# Altium schematic sheet nfc-epd-top.SchDoc
size Letter
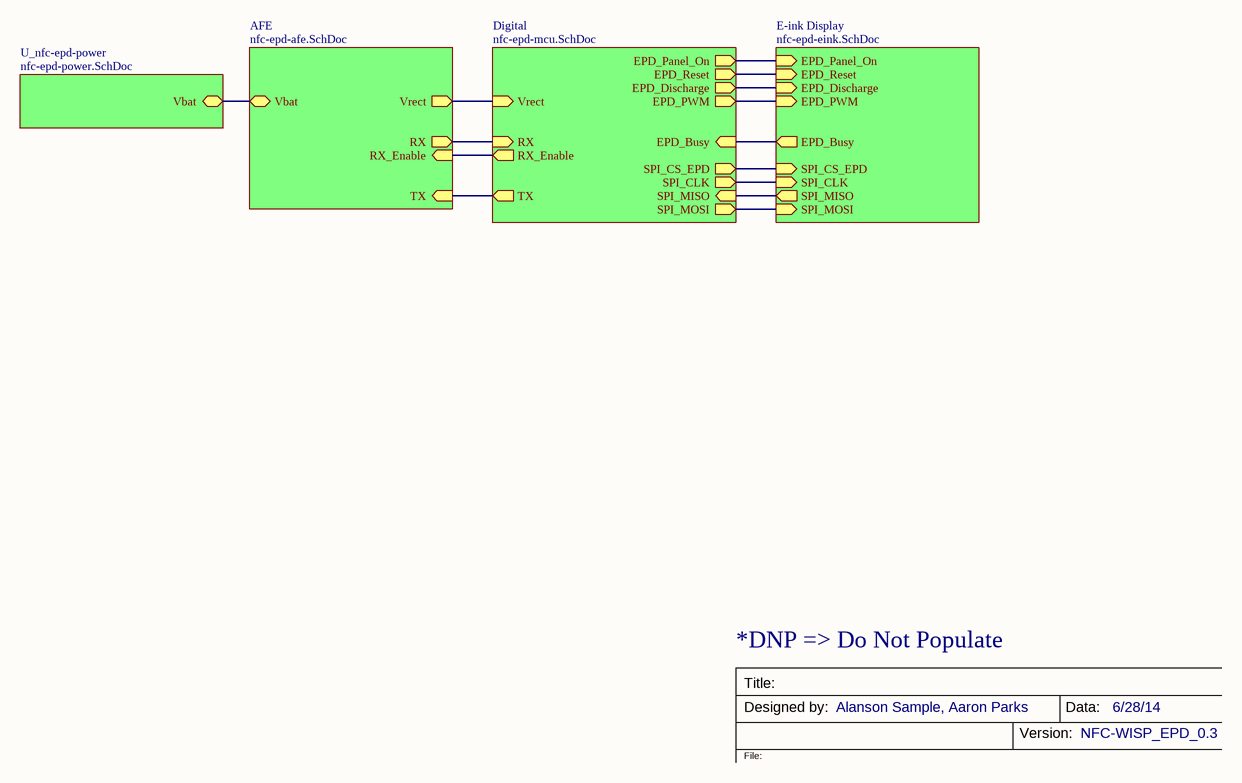
[diagram p0: nfc-epd-top.SchDoc]

## Sub-sheets
AFE = nfc-epd-afe.SchDoc: RX (out), TX (in), RX_Enable (in), Vrect (out), Vbat (bidir)
Digital = nfc-epd-mcu.SchDoc: RX (in), TX (out), SPI_MOSI (out), SPI_MISO (in), SPI_CLK (out), SPI_CS_EPD (out), EPD_Busy (in), EPD_Reset (out), EPD_Panel_On (out), EPD_Discharge (out), EPD_PWM (out), RX_Enable (out), Vrect (in)
E-ink Display = nfc-epd-eink.SchDoc: SPI_CS_EPD (in), EPD_Busy (out), SPI_CLK (in), SPI_MOSI (in), SPI_MISO (out), EPD_Reset (in), EPD_Panel_On (in), EPD_Discharge (in), EPD_PWM (in)
U_nfc-epd-power = nfc-epd-power.SchDoc: Vbat (bidir)

## Nets
(unnamed): sheet Digital/RX, sheet AFE/RX
(unnamed): sheet Digital/TX, sheet AFE/TX
(unnamed): sheet Digital/SPI_MOSI, sheet E-ink Display/SPI_MOSI
(unnamed): sheet Digital/SPI_MISO, sheet E-ink Display/SPI_MISO
(unnamed): sheet Digital/SPI_CLK, sheet E-ink Display/SPI_CLK
(unnamed): sheet Digital/SPI_CS_EPD, sheet E-ink Display/SPI_CS_EPD
(unnamed): sheet Digital/EPD_Busy, sheet E-ink Display/EPD_Busy
(unnamed): sheet Digital/EPD_Reset, sheet E-ink Display/EPD_Reset
(unnamed): sheet Digital/EPD_Panel_On, sheet E-ink Display/EPD_Panel_On
(unnamed): sheet Digital/EPD_Discharge, sheet E-ink Display/EPD_Discharge
(unnamed): sheet Digital/EPD_PWM, sheet E-ink Display/EPD_PWM
(unnamed): sheet Digital/RX_Enable, sheet AFE/RX_Enable
(unnamed): sheet Digital/Vrect, sheet AFE/Vrect
(unnamed): sheet AFE/Vbat, sheet U_nfc-epd-power/Vbat

## Notes on the sheet
- *DNP => Do Not Populate
- Title:
- Designed by:
- Alanson Sample, Aaron Parks
- Version:
- Data:
- NFC-WISP_EPD_0.3
- 6/28/14
- File: